# EAGLE design Line Protection (EAGLE 7.7.0)
AUTHOR: Nathan Campos; REVISION: A
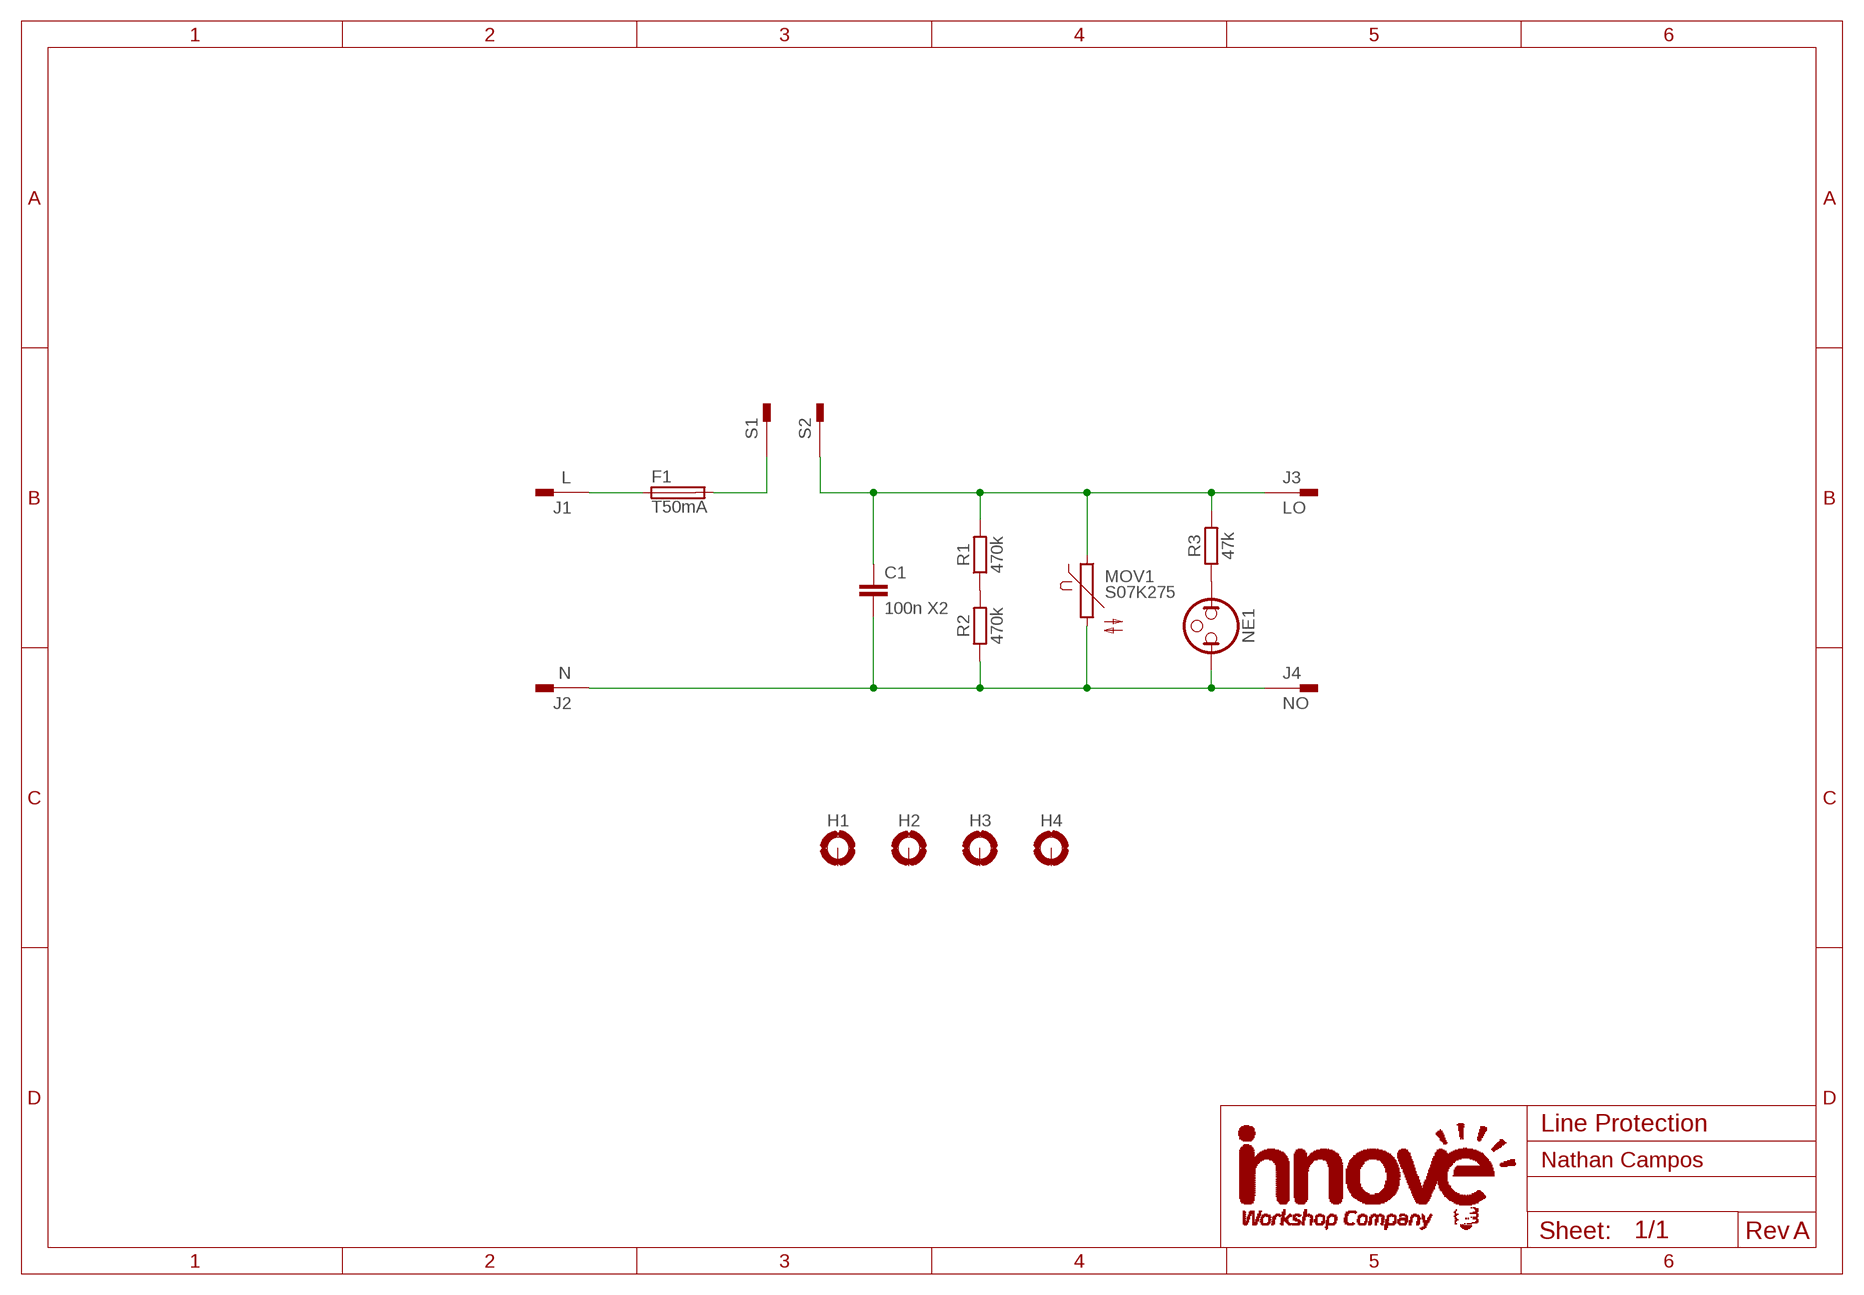
[diagram p0: schematic, sheet 1]

## Parts
C1  100n X2  C15-5.4X18.3  [C150-054X183]
F1  T50mA  CFH14  [CFH14]
H1  MOUNT-PAD-ROUND3.0  [3,0-PAD]
H2  MOUNT-PAD-ROUND3.0  [3,0-PAD]
H3  MOUNT-PAD-ROUND3.0  [3,0-PAD]
H4  MOUNT-PAD-ROUND3.0  [3,0-PAD]
J1  L  FASTON-250D140  [F061.100]
J2  N  FASTON-250D140  [F061.100]
J3  LO  FASTON-250D140  [F061.100]
J4  NO  FASTON-250D140  [F061.100]
MOV1  S07K275  [S07K275]
NE1  NEON-T2  [NEON-T2]
R1  470k  RT0207  [0207/10]
R2  470k  RT0207  [0207/10]
R3  47k  RT0207  [0207/10]
S1  FASTON-250D140  [F061.100]
S2  FASTON-250D140  [F061.100]

## Nets
N$1: F1.1 J1.A1 J1.A2
N$5: R1.1 R2.2
N$6: NE1.1 R3.1
N$7: F1.2 S1.A1 S1.A2
NEUTRAL: C1.2 J2.A1 J2.A2 J4.A1 J4.A2 MOV1.2 NE1.2 R2.1
SLIVE: C1.1 J3.A1 J3.A2 MOV1.1 R1.2 R3.2 S2.A1 S2.A2
Unconnected: H1.B3,0(MOUNT) H2.B3,0(MOUNT) H3.B3,0(MOUNT) H4.B3,0(MOUNT)

## Library data of the parts
C1 = innove-passives:C: Ceramic Capacitor Those little yellow/brown things
F1 = innove-fuses:CFH1: Fuse Holder 5x20mm semi-enclosed PCB mounting. Datasheet: http://www.farnell.com/datasheets/2863777.pdf
H1-H4 = innove-holes:MOUNT-PAD-ROUND: MOUNTING PAD, round
J1-J4 S1 S2 = innove-con-faston:FASTON-250: FASTON 250 - Printed Circuit Board Tabs Tab size: 6.35mm x 0.81mm; OC_FARNELL: unknown; OC_NEWARK: unknown
MOV1 = innove-varistors:S07K275: VARISTOR
NE1 = innove-opto:NEON: Neon Lamp For that warm, cozy, high voltage, vintage glow.
R1-R3 = innove-passives:R: Resistor This is officially the most boring component ever.

## Board
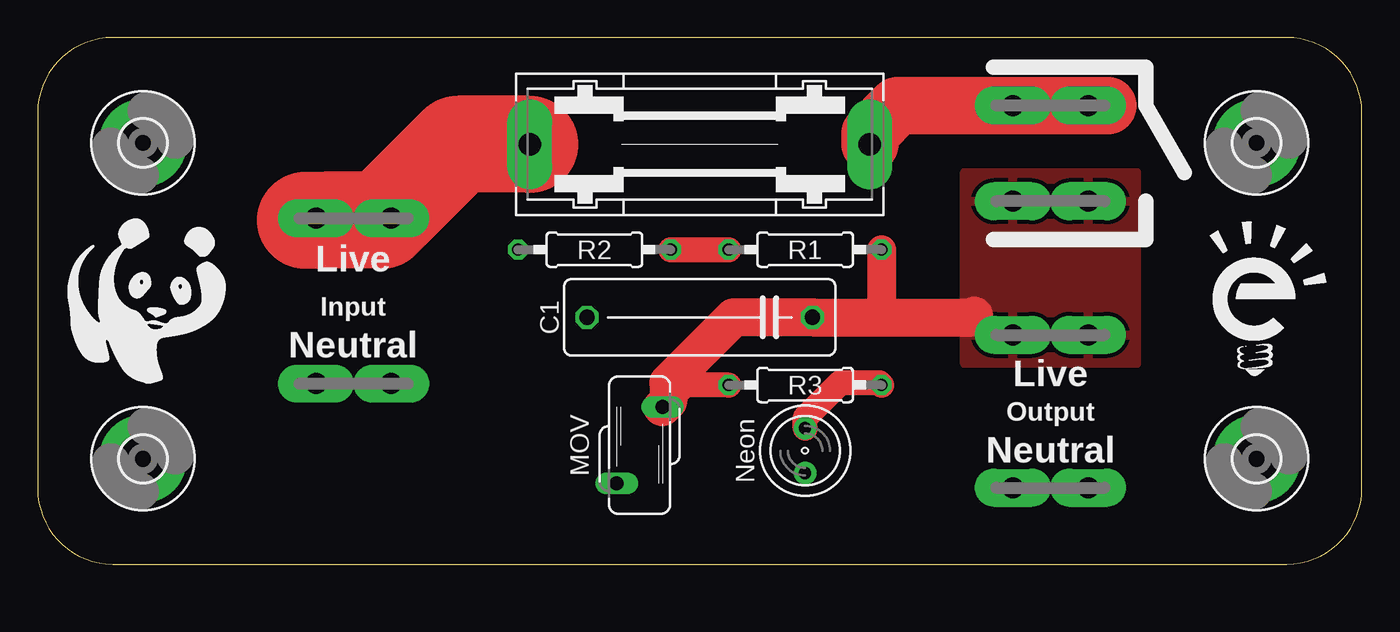
[diagram p1: board, top side]
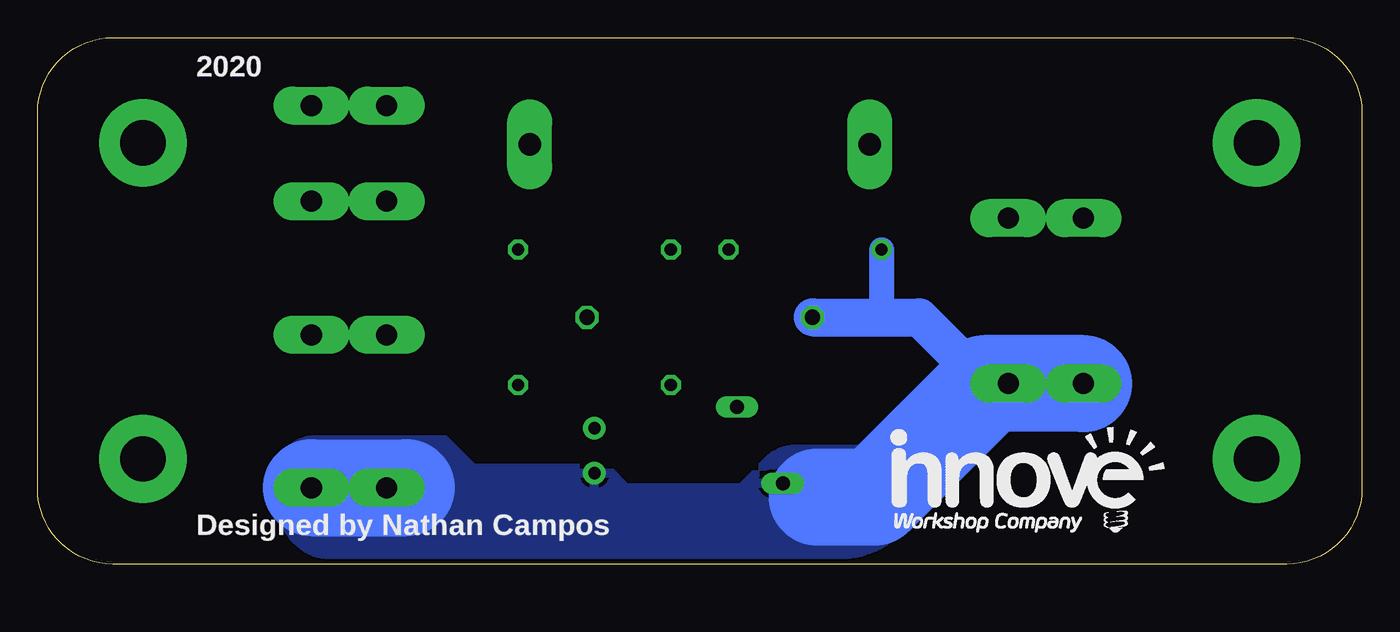
[diagram p2: board, bottom side, seen from below]

Size 88 x 35 mm. Coordinates in mm from the lower left corner, seen from the top.
Outline: 0,30 0,5 arc90 5,0 83,0 arc90 88,5 88,30 arc90 83,35 5,35 arc90 0,30
Copper layers (1*16): Top 0.035mm / dielectric 1.5mm / Bottom 0.035mm
Design rules "seeedstudio-2layers": minimum track width 6mil, minimum drill 12mil, track to track 6mil, track to pad 6mil, pad to pad 6mil, via to via 6mil, smd to smd 0mil, copper to edge 10mil, drill to drill 10mil, minimum pad ring 10mil, minimum via ring 6mil, stop-mask expansion 2mil, vias tented up to drill 100mil, thermal gap 10mil

### Footprints (pad centres in the part's own frame; a part is rotated, then mirrored left to right if it is on the bottom)
C150-054X183 = drill 1.016 octagon: 1 -7.493,0; 2 7.493,0
CFH14 = drill 1.5 pad 3 long: 1 -11.3,0; 2 11.3,0
3,0-PAD = drill 3 pad 5.842: B3,0 0,0
F061.100 = drill 1.4 pad 2.54 long: A1 -2.5,0; A2 2.5,0
S07K275 = drill 0.914 long: 1 -1.524,-2.54; 2 1.524,2.54
NEON-T2 = drill 0.813 pad 1.5: 1 -1.5,0; 2 1.5,0
0207/10 = drill 0.813 octagon: 1 -5.08,0; 2 5.08,0

### Placement (x,y rotation side)
C1  44,16.41 180 top
F1  44,27.91 0 top
H1  7,28 0 top
H2  7,7 0 top
H3  81,28 0 top
H4  81,7 0 top
J1  21,23 0 top
J2  21,12 0 top
J3  67.31,15.24 0 top
J4  67.31,5.08 0 top
MOV1  40,7.91 180 top
NE1  51,7.54 270 top
R1  51,20.91 0 top
R2  37,20.91 0 top
R3  51,11.9 180 top
S1  67.31,30.48 180 top
S2  67.31,24.13 180 top

### Tracks (layer width: path | path; a pad name or v marks a point on that pad's centre or on a via)
N$1
  Top 0.61: 22.86,22.86 23.36,22.86 J1.A2
  Top 1.93: 19.05,22.86 18.64,22.86 J1.A1
  Top 6.452: F1.1 27.91,27.91 22.86,22.86 19.05,22.86 17.78,22.86
N$5
  Top 1.676: R2.2 R1.1
N$6
  Top 1.676: NE1.1 51,9.72 53.34,12.06 55.92,12.06 R3.1
N$7
  Top 3.81: F1.2 55.3,28.63 57.15,30.48 S1.A2 S1.A1 71.12,30.48
NEUTRAL
  Bottom 1.676: R2.1 31.92,16.57 31.75,16.41
  Bottom 2.54: C1.2 31.75,16.41 29.41,16.41 25,12 | 26.67,11.43 25.4,11.43 24.07,11.43 J2.A2
  Bottom 6.452: J2.A1 25,12 25.11,12 25.11,11.71 25.4,11.43 32.38,4.45 36.2,4.45 | J4.A2 63.5,5.08
  pour Bottom: 30.48,7.62 37.65,7.62 arc-45 39.5,6.85 41.27,5.08 48.9,5.08 50.16,6.35 59.05,6.35 60.96,8.26 69.65,8.26 arc-45 71.07,7.67 71.75,6.99 71.75,3.87 arc-90 68.52,0.64 34.65,0.64 arc-45 30.79,2.23 27.94,5.08
SLIVE
  Top 1.676: R3.2 42.98,11.9 41.91,10.83
  Top 1.93: R1.2 56.08,16.61 55.88,16.41
  Top 2.54: MOV1.1 41.91,10.83 41.91,12.06 46.25,16.41 C1.1 55.88,16.41 62.12,16.41 62.23,16.51
  pour Top: 61.59,26.04 73.03,26.04 73.03,13.34 61.59,13.34

### Text on the board
tPlace: Live | Input | Neutral | Live | Output | MOV | Neon | Neutral
bPlace: 2020 | Designed by Nathan Campos